# EasyEDA Pro project line_sensor.eprj

# Schematic Schematic1
Board Name: Board1; Create Date: 2026-02-10; Page Name: P1; Project Name: line_sensor; Schematic Name: Schematic1; Update Date: 2026-02-10; Company: EasyEDA.com; Page Size: A4; Version: V1.0
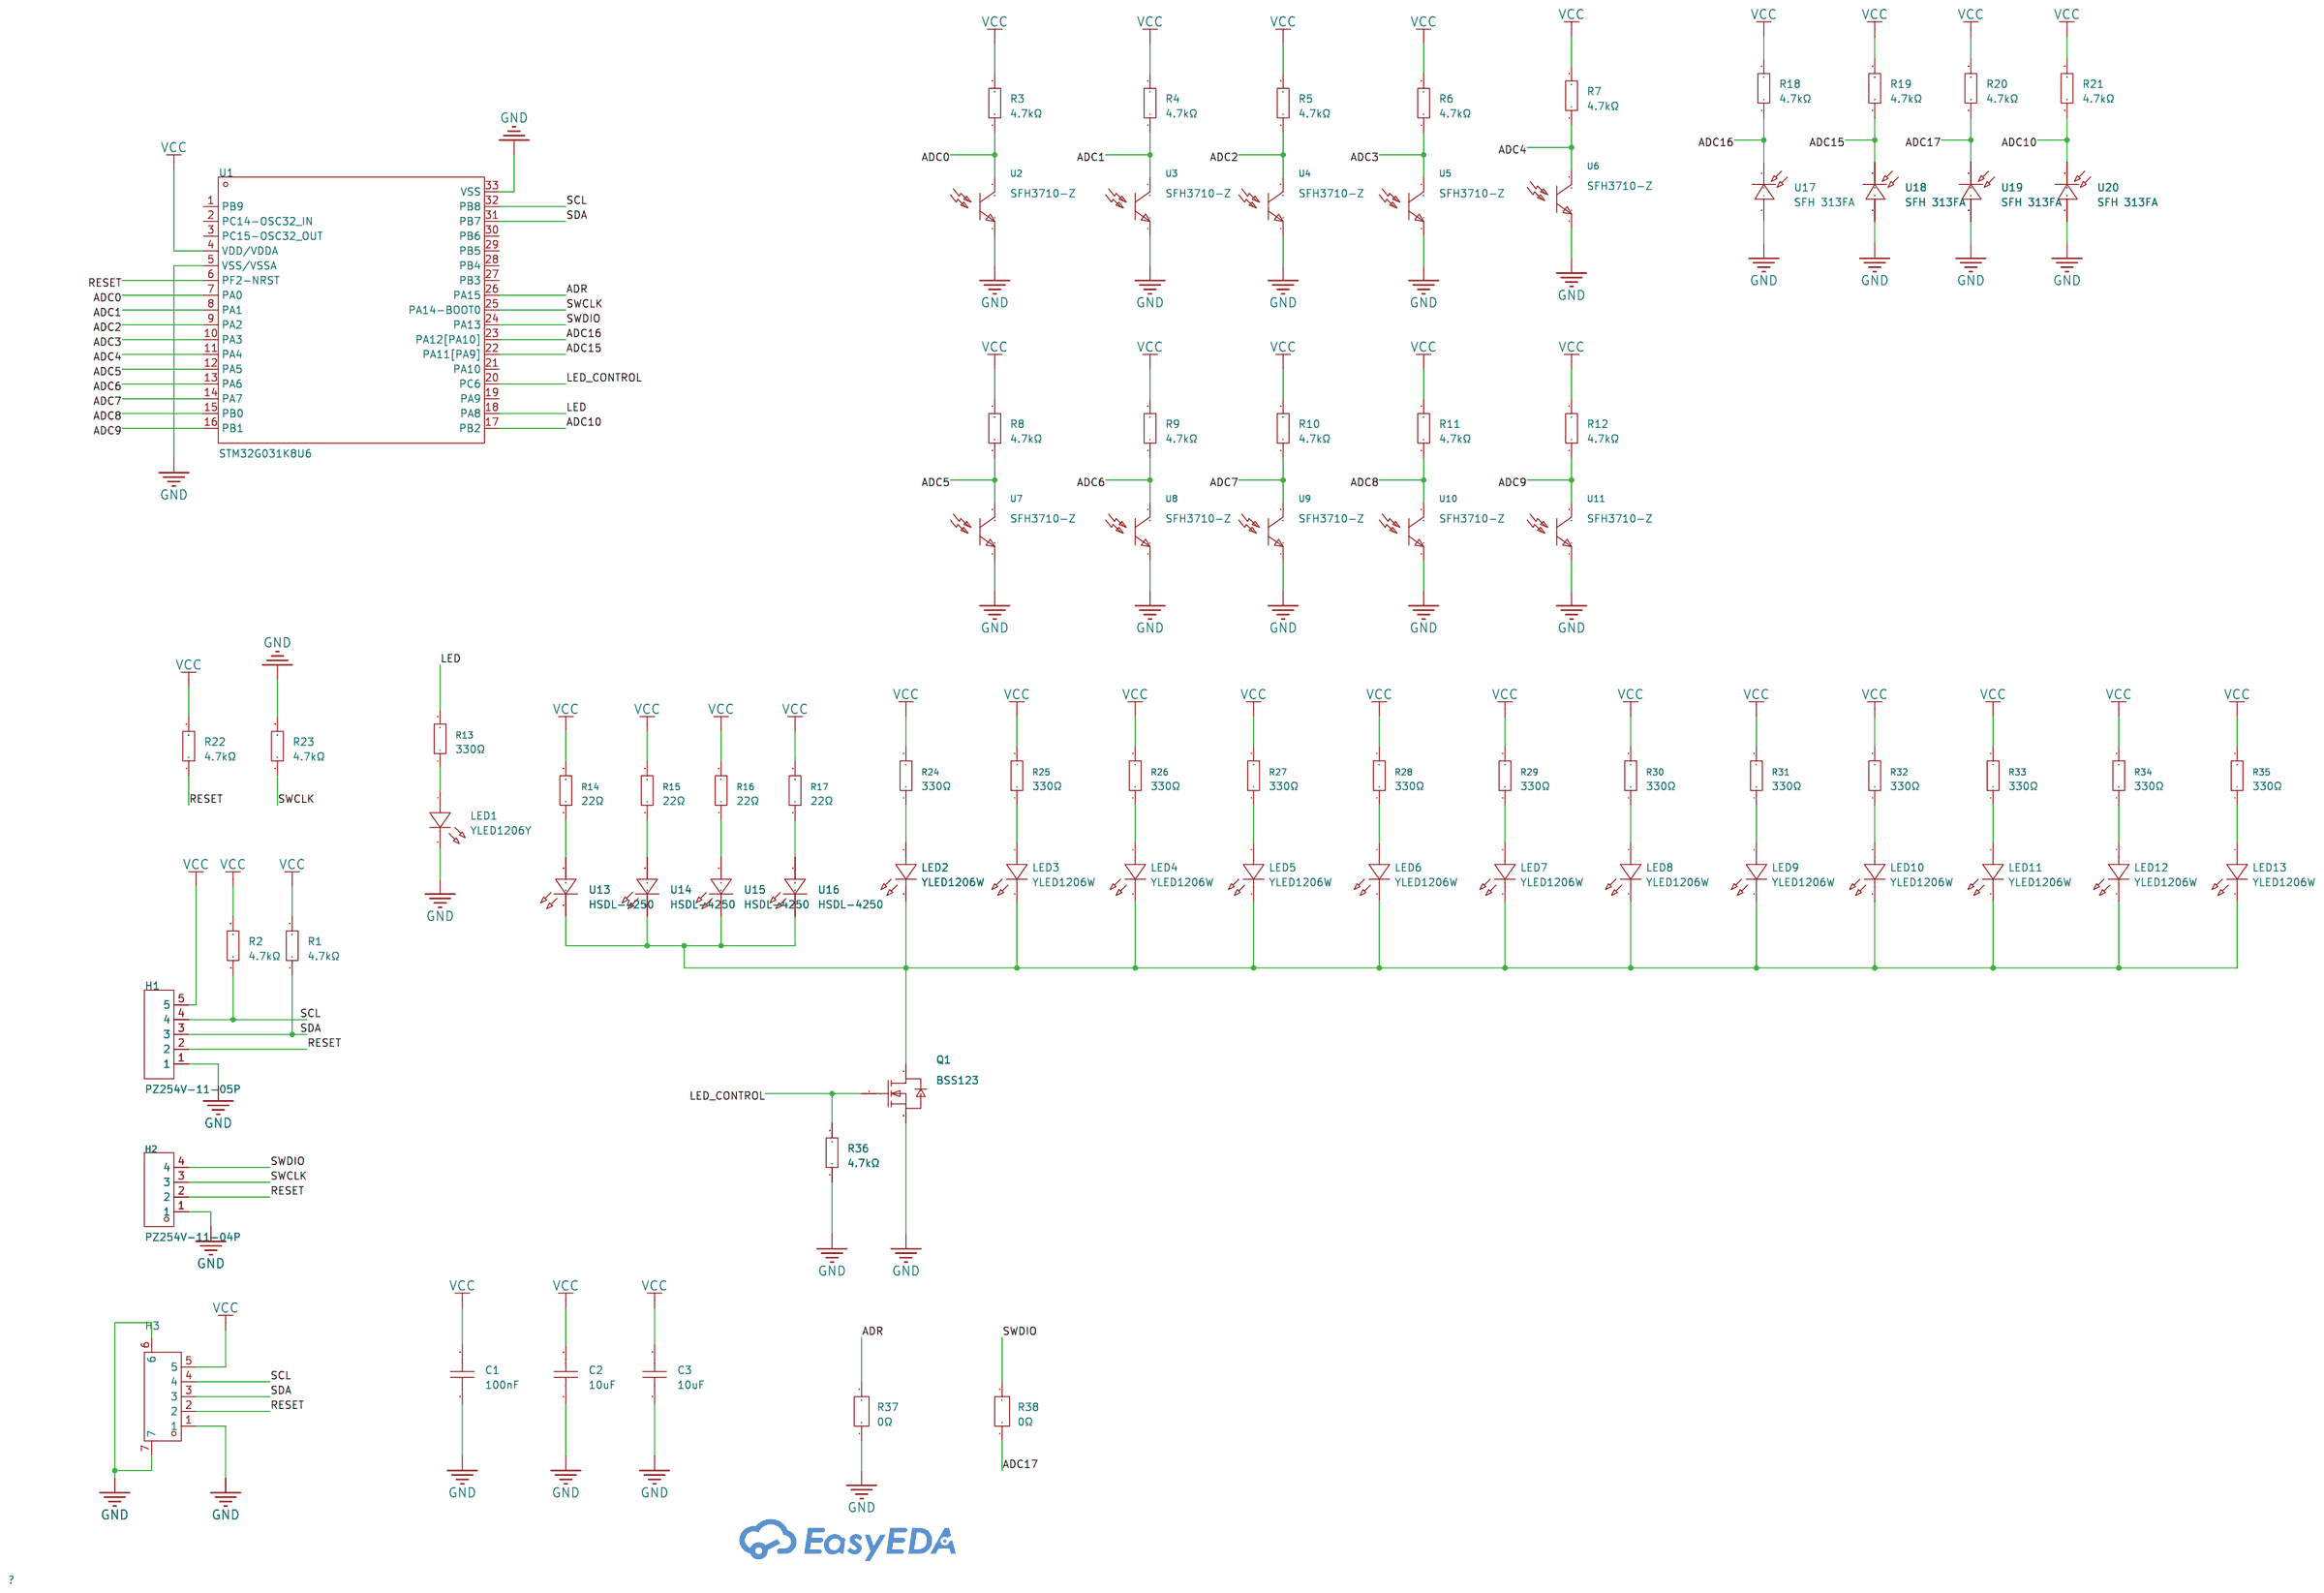
[diagram p0: schematic sheet]

## Parts
C1  100nF  [C0805]
C2  10uF  [C0805]
C3  10uF  [C0805]
H1  PZ254V-11-05P  [HDR-TH_5P-P2.54-V-M]
H2  PZ254V-11-04P  [HDR-TH_4P-P2.54-V-M]
H3  GT-F0509SR15-05SMT01  [CONN-SMD_GT-F0509SR15-05SMT01]
LED1  YLED1206Y  [LED1206-FD]
LED2  YLED1206W  [LED1206-R-RD]
LED3  YLED1206W  [LED1206-R-RD]
LED4  YLED1206W  [LED1206-R-RD]
LED5  YLED1206W  [LED1206-R-RD]
LED6  YLED1206W  [LED1206-R-RD]
LED7  YLED1206W  [LED1206-R-RD]
LED8  YLED1206W  [LED1206-R-RD]
LED9  YLED1206W  [LED1206-R-RD]
LED10  YLED1206W  [LED1206-R-RD]
LED11  YLED1206W  [LED1206-R-RD]
LED12  YLED1206W  [LED1206-R-RD]
LED13  YLED1206W  [LED1206-R-RD]
Q1  BSS123  [SOT-23-3_L3.0-W1.7-P0.95-LS2.9-BR]
R1  4.7kΩ  [R0805]
R2  4.7kΩ  [R0805]
R3  4.7kΩ  [R0805]
R4  4.7kΩ  [R0805]
R5  4.7kΩ  [R0805]
R6  4.7kΩ  [R0805]
R7  4.7kΩ  [R0805]
R8  4.7kΩ  [R0805]
R9  4.7kΩ  [R0805]
R10  4.7kΩ  [R0805]
R11  4.7kΩ  [R0805]
R12  4.7kΩ  [R0805]
R13  330Ω  [R0805]
R14  22Ω  [R0805]
R15  22Ω  [R0805]
R16  22Ω  [R0805]
R17  22Ω  [R0805]
R18  4.7kΩ  [R0805]
R19  4.7kΩ  [R0805]
R20  4.7kΩ  [R0805]
R21  4.7kΩ  [R0805]
R22  4.7kΩ  [R0805]
R23  4.7kΩ  [R0805]
R24  330Ω  [R0805]
R25  330Ω  [R0805]
R26  330Ω  [R0805]
R27  330Ω  [R0805]
R28  330Ω  [R0805]
R29  330Ω  [R0805]
R30  330Ω  [R0805]
R31  330Ω  [R0805]
R32  330Ω  [R0805]
R33  330Ω  [R0805]
R34  330Ω  [R0805]
R35  330Ω  [R0805]
R36  4.7kΩ  [R0805]
R37  0Ω  [R0603]
R38  0Ω  [R0603]
U1  STM32G031K8U6  [UFQFPN-32_L5.0-W5.0-P0.50-BL-EP]
U2  SFH3710-Z  [OPTO-SMD_SFH3710-Z]
U3  SFH3710-Z  [OPTO-SMD_SFH3710-Z]
U4  SFH3710-Z  [OPTO-SMD_SFH3710-Z]
U5  SFH3710-Z  [OPTO-SMD_SFH3710-Z]
U6  SFH3710-Z  [OPTO-SMD_SFH3710-Z]
U7  SFH3710-Z  [OPTO-SMD_SFH3710-Z]
U8  SFH3710-Z  [OPTO-SMD_SFH3710-Z]
U9  SFH3710-Z  [OPTO-SMD_SFH3710-Z]
U10  SFH3710-Z  [OPTO-SMD_SFH3710-Z]
U11  SFH3710-Z  [OPTO-SMD_SFH3710-Z]
U13  HSDL-4250  [LED-TH_BD5.0-P2.54-FD-1]
U14  HSDL-4250  [LED-TH_BD5.0-P2.54-FD-1]
U15  HSDL-4250  [LED-TH_BD5.0-P2.54-FD-1]
U16  HSDL-4250  [LED-TH_BD5.0-P2.54-FD-1]
U17  SFH 313FA  [OPTO-TH_BD5.7-P2.54-D0.8]
U18  SFH 313FA  [OPTO-TH_BD5.7-P2.54-D0.8]
U19  SFH 313FA  [OPTO-TH_BD5.7-P2.54-D0.8]
U20  SFH 313FA  [OPTO-TH_BD5.7-P2.54-D0.8]

## Library data of the parts
C1 = CC0805KRX7R9BB104: LCSC Part Name: 100nF ±10% 50V; Supplier Part: C49678; Manufacturer: YAGEO(国巨); Supplier Footprint: 0805; JLCPCB Part Class: Basic Part; Datasheet: https://item.szlcsc.com/datasheet/CC0805KRX7R9BB104/50686.html; Supplier: LCSC; Tolerance: ±10%; Voltage Rating: 50V; Temperature Coefficient: X7R
C2 C3 = CL21A106KBYQNNE: LCSC Part Name: 10uF ±10% 50V; Supplier Part: C2932476; Manufacturer: SAMSUNG(三星); Supplier Footprint: 0805; JLCPCB Part Class: Extended Part; Datasheet: https://item.szlcsc.com/datasheet/CL21A106KBYQNNE/3277789.html; Supplier: LCSC; Tolerance: ±10%; Voltage Rating: 50V; Temperature Coefficient: X5R
H1 = PZ254V-11-05P: LCSC Part Name: 1x5P 间距:2.54mm 方针 直插; Supplier Part: C492404; Manufacturer: XFCN(兴飞); Supplier Footprint: 插件,P=2.54mm; JLCPCB Part Class: Extended Part; Datasheet: https://item.szlcsc.com/datasheet/PZ254V-11-05P/502960.html; Supplier: LCSC; Pin Structure: 1x5P; Pitch: 2.54mm; Circluar Pins/Square Pins: Pin Header; Mounting Type: Through Hole; Number of Rows: 1; Number of Pins: 5P; Length of Mating Pin: 6mm; Insulation Height: 2.5mm; Length of End Connection Pin: 3mm; Contact Material: Brass; Operating Temperature: -40℃~+105℃; Color: Black
H2 = PZ254V-11-04P: LCSC Part Name: 1x4P 间距:2.54mm 方针 直插; Supplier Part: C2691448; Manufacturer: XFCN(兴飞); Supplier Footprint: 插件,P=2.54mm; JLCPCB Part Class: Extended Part; Datasheet: https://item.szlcsc.com/datasheet/PZ254V-11-04P/2801085.html; Supplier: LCSC; Pin Structure: 1x4P; Pitch: 2.54mm; Circluar Pins/Square Pins: Pin Header; Mounting Type: Through Hole; Number of Rows: 1; Number of Pins: 4P; Current Rating: 3A; Voltage Rating (Max): 250V; Length of Mating Pin: 6mm; Insulation Height: 2.5mm; Length of End Connection Pin: 3mm; Operating Temperature: -40℃~+105℃; Color: Black
H3 = GT-F0509SR15-05SMT01: Locking Feature:Hinged Lid Contact Type:Bottom Contact Number of Contacts:5P Pitch:0.5mm Mounting Type:Surface Mount, Right Angle FFC, FCB Thickness:0.3mm FFC, FCB Thickness:0.3mm Height Above Board:1.53mm Contact Material:Phosphor Bronze Contact Plating:; LCSC Part Name: 翻盖式 下接 P数:5P 间距:0.5mm; Supplier Part: C21882317; Manufacturer: G-Switch(品赞); Supplier Footprint: SMD,P=0.5mm,卧贴; JLCPCB Part Class: Extended Part; Datasheet: https://item.szlcsc.com/datasheet/GT-F0509SR15-05SMT01/23309883.html; Supplier: LCSC; Locking Feature: Hinged Lid; Contact Type: Bottom Contact; Number of Contacts: 5P; Pitch: 0.5mm; Mounting Type: Surface Mount, Right Angle; FFC, FCB Thickness: 0.3mm; Height Above Board: 1.53mm; Contact Material: Phosphor Bronze; Contact Plating: Tin; Operating Temperature: -25℃~+85℃
LED1 = YLED1206Y: LCSC Part Name: 发光管; Supplier Part: C30584802; Manufacturer: YONGYUTAI(永裕泰); Supplier Footprint: 1206; JLCPCB Part Class: Extended Part; Datasheet: https://item.szlcsc.com/datasheet/YLED1206Y/32319014.html; Supplier: LCSC; Illumination Color: Yellow; Voltage - Forward(Vf): 1.8V~2.4V; Power(Watts): 48mW; Forward Current: 20mA; Wavelength - Dominant: 584nm~594nm; Peak Wavelength: 596nm; Luminous Intensity: 70mcd~210mcd; Viewing Angle: 120°; Operating Temperature: -40℃~+85℃
LED2-LED13 = YLED1206W: LCSC Part Name: 发光管; Supplier Part: C28310437; Manufacturer: YONGYUTAI(永裕泰); Supplier Footprint: 1206; JLCPCB Part Class: Extended Part; Datasheet: https://item.szlcsc.com/datasheet/YLED1206W/30046764.html; Supplier: LCSC; Illumination Color: White; Voltage - Forward(Vf): 2.6V~3.1V; Power(Watts): 70mW; Forward Current: 20mA; Color Temperature: 13969K~100000K; Luminous Intensity: 175mcd~430mcd; Viewing Angle: 120°; Operating Temperature: -40℃~+85℃
Q1 = BSS123_2: LCSC Part Name: N沟道,电流:170mA,耐压:100V; Supplier Part: C41355122; Manufacturer: Siliup(矽普); Supplier Footprint: SOT-23; Datasheet: https://atta.szlcsc.com/upload/public/pdf/source/20240815/F5B63F8FE9D005365415E1A86BED304A.pdf; Supplier: LCSC; Drain to Source Voltage: 100V; Current - Continuous Drain(Id): 170mA; RDS(on): 4.3Ω@4.5V,200mA; Pd - Power Dissipation: 350mW; Gate Threshold Voltage (Vgs(th)@Id): 2.5V; Gate Charge(Qg): 2nC@10V; Input Capacitance(Ciss): 60pF; Reverse Transfer Capacitance (Crss@Vds): 6pF; Operating Temperature: -55℃~+150℃
R1-R12 R18-R23 R36 = 0805W8F4701T5E: LCSC Part Name: 4.7kΩ ±1% 125mW 厚膜电阻; Supplier Part: C17673; Manufacturer: UNI-ROYAL(厚声); Supplier Footprint: 0805; JLCPCB Part Class: Basic Part; Datasheet: https://atta.szlcsc.com/upload/public/pdf/source/20200306/C422600_1E6D84923E4A46A82E41ADD87F860B5C.pdf; Supplier: LCSC; Type: Thick Film Resistors; Tolerance: ±1%; Temperature Coefficient: ±100ppm/℃; Operating Temperature Range: -55℃~+155℃
R13-R17 R24-R35 = 0805W8F3300T5E: LCSC Part Name: 330Ω ±1% 125mW 厚膜电阻; Supplier Part: C17630; Manufacturer: UNI-ROYAL(厚声); Supplier Footprint: 0805; JLCPCB Part Class: Basic Part; Datasheet: https://item.szlcsc.com/datasheet/0805W8F3300T5E/18318.html; Supplier: LCSC; Type: Thick Film Resistor; Tolerance: ±1%; Power(Watts): 125mW; Voltage-Supply(Max): 150V; Temperature Coefficient: ±100ppm/℃; Operating Temperature: -55℃~+155℃
R37 R38 = FRC0603P000 TS: LCSC Part Name: 0Ω ±5% 100mW 厚膜电阻; Supplier Part: C2907080; Manufacturer: FOJAN(富捷); Supplier Footprint: 0603; JLCPCB Part Class: Extended Part; Supplier: LCSC; Type: Thick Film Resistor; Tolerance: ±5%; Power(Watts): 100mW; Voltage-Supply(Max): 75V; Operating Temperature: -55℃~+155℃
U1 = STM32G031K8U6: LCSC Part Name: 主流Arm Cortex-M0+ MCU，具有64 KB Flash存储器、8 KB RAM、64 MHz CPU、2x USART、定时器、ADC和通信接口，1.7-3.6V; Supplier Part: C432207; Manufacturer: ST(意法半导体); Supplier Footprint: UFQFPN-32(5x5); JLCPCB Part Class: Extended Part; Datasheet: https://item.szlcsc.com/datasheet/STM32G031K8U6/428995.html; Supplier: LCSC; CPU Core: ARM Cortex-M Series; CPU Maximum Speed: 64MHz; Program Storage Size: 64KB; Program Memory Type: FLASH; Number of I/O: 30; ADC (Bit): 12bit; Voltage - Supply: 1.7V~3.6V
U2-U11 = SFH3710-Z: LCSC Part Name: 570nm光电三极管; Supplier Part: C129152; Manufacturer: OSRAM(欧司朗); Supplier Footprint: SMD,3.2x1.3mm; JLCPCB Part Class: Extended Part; Datasheet: https://item.szlcsc.com/datasheet/SFH3710-Z/140438.html; Supplier: LCSC; type: NPN; Collector - Emitter Voltage VCEO: 5.5V; Current - Collector(Ic): 20mA; Current - Dark(Id): 3nA; Peak Wavelength: 570nm; Viewing Angle: ±60°; Operating Temperature: -40℃~+85℃
U13-U16 = HSDL-4250: Supplier Part: C5730862; Manufacturer: LITEON(光宝); JLCPCB Part Class: Extended Part; Datasheet: https://item.szlcsc.com/datasheet/HSDL-4250/6656316.html; Supplier: LCSC; Voltage - Forward(Vf): 1.4V; Wavelength: 870nm; Radiant Intensity: 124mW/sr@100mA; Operating Temperature: -40℃~+85℃
U17-U20 = SFH 313FA: Supplier Part: C3210896; Manufacturer: OSRAM(欧司朗); Supplier Footprint: 插件; JLCPCB Part Class: Extended Part; Supplier: LCSC; Collector Emitter Voltage: 70V; Collector Current (Ic): 50mA; Dissipation Power(Max): 200mW; Collector Dark Current: 200nA; Peak Wavelength: 870nm; Operating Temperature: -40℃~+100℃

## Nets
GND: C1.1 C2.1 C3.1 H1.1 H2.1 H3.1 H3.6 H3.7 LED1.2(C) Q1.2(S) R23.2 R36.1 R37.1 U1.5(VSS/VSSA) U1.33(VSS) U2.1(E) U3.1(E) U4.1(E) U5.1(E) U6.1(E) U7.1(E) U8.1(E) U9.1(E) U10.1(E) U11.1(E) U17.2(A) U18.2(A) U19.2(A) U20.2(A)
VCC: C1.2 C2.2 C3.2 H1.5 H3.5 R1.2 R2.2 R3.2 R4.2 R5.2 R6.2 R7.2 R8.2 R9.2 R10.2 R11.2 R12.2 R14.2 R15.2 R16.2 R17.2 R18.2 R19.2 R20.2 R21.2 R22.2 R24.2 R25.2 R26.2 R27.2 R28.2 R29.2 R30.2 R31.2 R32.2 R33.2 R34.2 R35.2 U1.4(VDD/VDDA)
ADC0: R3.1 U1.7(PA0) U2.2(C)
ADC1: R4.1 U1.8(PA1) U3.2(C)
ADC2: R5.1 U1.9(PA2) U4.2(C)
ADC3: R6.1 U1.10(PA3) U5.2(C)
ADC4: R7.1 U1.11(PA4) U6.2(C)
ADC5: R8.1 U1.12(PA5) U7.2(C)
ADC6: R9.1 U1.13(PA6) U8.2(C)
ADC7: R10.1 U1.14(PA7) U9.2(C)
ADC8: R11.1 U1.15(PB0) U10.2(C)
ADC9: R12.1 U1.16(PB1) U11.2(C)
ADC10: R21.1 U1.17(PB2) U20.1(C)
ADC15: R19.1 U1.22(PA11[PA9]) U18.1(C)
ADC16: R18.1 U1.23(PA12[PA10]) U17.1(C)
ADC17: R20.1 R38.1 U19.1(C)
ADR: R37.2 U1.26(PA15)
LED: R13.2 U1.18(PA8)
LED_CONTROL: Q1.1(G) R36.2 U1.20(PC6)
RESET: H1.2 H2.2 H3.2 R22.1 U1.6(PF2-NRST)
SCL: H1.4 H3.4 R2.1 U1.32(PB8)
SDA: H1.3 H3.3 R1.1 U1.31(PB7)
SWCLK: H2.3 R23.1 U1.25(PA14-BOOT0)
SWDIO: H2.4 R38.2 U1.24(PA13)
$1N3964: R14.1 U13.1(A)
$1N3993: R15.1 U14.1(A)
$1N3998: R16.1 U15.1(A)
$1N4003: R17.1 U16.1(A)
$1N4008: LED2.2(K) LED3.2(K) LED4.2(K) LED5.2(K) LED6.2(K) LED7.2(K) LED8.2(K) LED9.2(K) LED10.2(K) LED11.2(K) LED12.2(K) LED13.2(K) Q1.3(D) U13.2(C) U14.2(C) U15.2(C) U16.2(C)
$1N4729: LED1.1(A) R13.1
$1N4864: LED2.1(A) R24.1
$1N4985: LED3.1(A) R25.1
$1N5087: LED4.1(A) R26.1
$1N5189: LED5.1(A) R27.1
$1N5291: LED6.1(A) R28.1
$1N5393: LED7.1(A) R29.1
$1N5495: LED8.1(A) R30.1
$1N5597: LED9.1(A) R31.1
$1N5699: LED10.1(A) R32.1
$1N5801: LED11.1(A) R33.1
$1N5903: LED12.1(A) R34.1
$1N6005: LED13.1(A) R35.1

Not connected (* = marked no-connect by the designer): U1 1(PB9) 2(PC14-OSC32_IN) 3(PC15-OSC32_OUT) 19(PA9) 21(PA10) 27(PB3) 28(PB4) 29(PB5) 30(PB6)

# Board PCB1
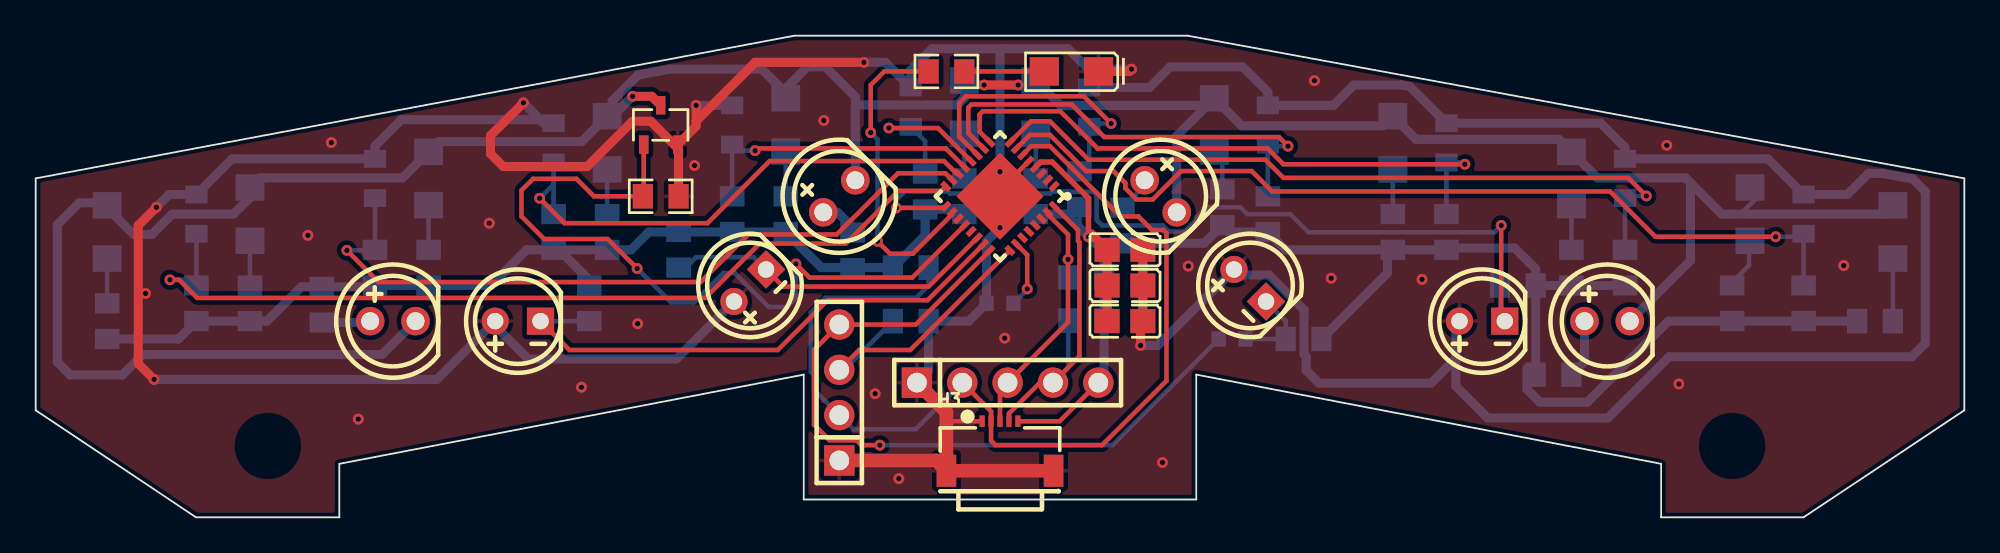
[diagram p1: board, top side]
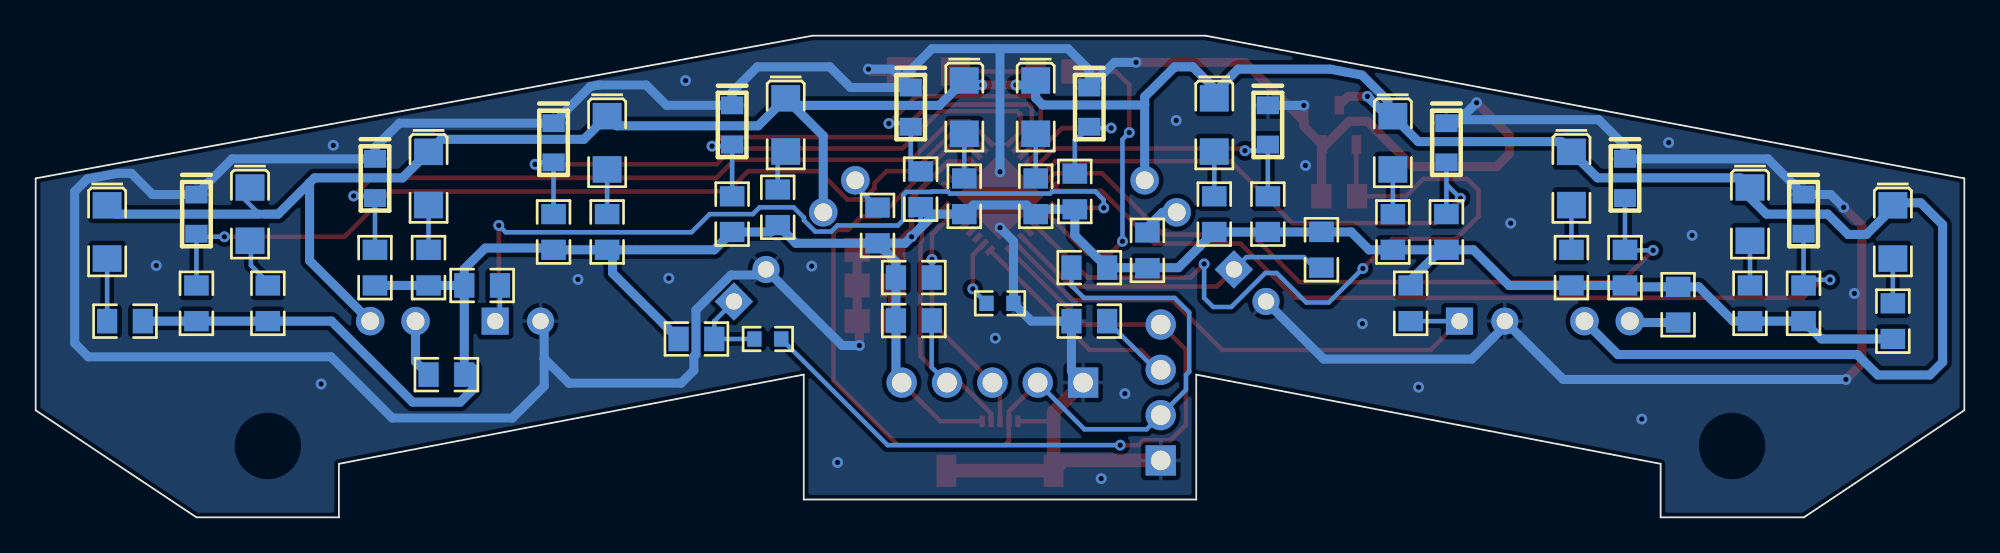
[diagram p2: board, bottom side, seen from below]

Outline 108 x 27.01 mm; copper layers: Top Layer, Bottom Layer. Coordinates in mm from the lower left corner of the outline.
Outline path: 0,19 0,6 8.98,0 17,0 17,3 43.01,8 43.01,1 64.99,1 64.99,8 91.02,3 91.02,0 99,0 108,6 108,19 64.49,27.01 42.49,27.01 0,19
Stack: Top Layer 0.035mm / Dielectric1 1.51mm FR4 er 4.5 / Bottom Layer 0.035mm

## Design rules (mm)
template: JLCPCB Capability(Two Layers Board)
spacing copperThickness1oz (default): track to track 0.102, other pairs 0.152 to 0.3
spacing copperThickness2oz: track to track 0.203, other pairs 0.152 to 0.3
track width copperThickness1oz (default): min 0.127, default 0.254, max 2.54
track width copperThickness2oz: min 0.203, default 0.254, max 2.54
differential pair differentialPair (default): width min 0.127, default 0.254, max 2.54; gap min 0.152, default 0.152
via viaSize (default): diameter min 0.5, default 0.61, max 10; hole min 0.3, default 0.305, max 6.3

## Placement (name value [footprint] x y rotation side)
C1  100nF  [C0805]  61 15 180 top
C2  10uF  [C0805]  61 13 180 top
C3  10uF  [C0805]  61 11 180 top
H1  PZ254V-11-05P  [HDR-TH_5P-P2.54-V-M]  54.43 7.55 0 top
H2  PZ254V-11-04P  [HDR-TH_4P-P2.54-V-M]  45 7 90 top
H3  GT-F0509SR15-05SMT01  [CONN-SMD_GT-F0509SR15-05SMT01]  54 4 0 top
LED1  YLED1206Y  [LED1206-FD]  58 25 0 top
LED2  YLED1206W  [LED1206-R-RD]  12 17 270 bottom
LED3  YLED1206W  [LED1206-R-RD]  22 19 270 bottom
LED4  YLED1206W  [LED1206-R-RD]  32 21 270 bottom
LED5  YLED1206W  [LED1206-R-RD]  42 22 270 bottom
LED6  YLED1206W  [LED1206-R-RD]  52 23 270 bottom
LED7  YLED1206W  [LED1206-R-RD]  56 23 270 bottom
LED8  YLED1206W  [LED1206-R-RD]  66 22 270 bottom
LED9  YLED1206W  [LED1206-R-RD]  76 21 270 bottom
LED10  YLED1206W  [LED1206-R-RD]  86 19 270 bottom
LED11  YLED1206W  [LED1206-R-RD]  96 17 270 bottom
LED12  YLED1206W  [LED1206-R-RD]  104 16 270 bottom
LED13  YLED1206W  [LED1206-R-RD]  4 16 270 bottom
Q1  BSS123  [SOT-23-3_L3.0-W1.7-P0.95-LS2.9-BR]  35 22 270 top
R1  4.7kΩ  [R0805]  58.83 13.44 0 bottom
R2  4.7kΩ  [R0805]  58.83 11.03 0 bottom
R3  4.7kΩ  [R0805]  99 12 270 bottom
R4  4.7kΩ  [R0805]  89 14 270 bottom
R5  4.7kΩ  [R0805]  79 16 270 bottom
R6  4.7kΩ  [R0805]  69 17 270 bottom
R7  4.7kΩ  [R0805]  58.44 18.4 270 bottom
R8  4.7kΩ  [R0805]  49.81 18.27 270 bottom
R9  4.7kΩ  [R0805]  39 17 270 bottom
R10  4.7kΩ  [R0805]  29 16 270 bottom
R11  4.7kΩ  [R0805]  19 14 270 bottom
R12  4.7kΩ  [R0805]  9 12 270 bottom
R13  330Ω  [R0805]  51 25 180 top
R14  22Ω  [R0805]  16.03 11.92 90 bottom
R15  22Ω  [R0805]  45.75 14.97 270 bottom
R16  22Ω  [R0805]  60.86 16.37 270 bottom
R17  22Ω  [R0805]  85 8 180 bottom
R18  4.7kΩ  [R0805]  31 12 90 bottom
R19  4.7kΩ  [R0805]  36 15 90 bottom
R20  4.7kΩ  [R0805]  71 10 0 bottom
R21  4.7kΩ  [R0805]  83 13 0 bottom
R22  4.7kΩ  [R0805]  49 14 180 bottom
R23  4.7kΩ  [R0805]  49 11 0 bottom
R24  330Ω  [R0805]  12 12 270 bottom
R25  330Ω  [R0805]  22 14 270 bottom
R26  330Ω  [R0805]  32 16 270 bottom
R27  330Ω  [R0805]  42 17 270 bottom
R28  330Ω  [R0805]  52 18 270 bottom
R29  330Ω  [R0805]  56 18 270 bottom
R30  330Ω  [R0805]  66.45 17.38 270 bottom
R31  330Ω  [R0805]  76 16 270 bottom
R32  330Ω  [R0805]  86 14 270 bottom
R33  330Ω  [R0805]  95 12 270 bottom
R34  330Ω  [R0805]  103 11 180 bottom
R35  330Ω  [R0805]  4 11 270 bottom
R36  4.7kΩ  [R0805]  35 18 180 top
R37  0Ω  [R0603]  54 12 0 bottom
R38  0Ω  [R0603]  67 10 180 bottom
U1  STM32G031K8U6  [UFQFPN-32_L5.0-W5.0-P0.50-BL-EP]  54 18 135 top
U2  SFH3710-Z  [OPTO-SMD_SFH3710-Z]  99 17 270 bottom
U3  SFH3710-Z  [OPTO-SMD_SFH3710-Z]  89 19 270 bottom
U4  SFH3710-Z  [OPTO-SMD_SFH3710-Z]  79 21 270 bottom
U5  SFH3710-Z  [OPTO-SMD_SFH3710-Z]  69 22 270 bottom
U6  SFH3710-Z  [OPTO-SMD_SFH3710-Z]  59 23 270 bottom
U7  SFH3710-Z  [OPTO-SMD_SFH3710-Z]  49 23 270 bottom
U8  SFH3710-Z  [OPTO-SMD_SFH3710-Z]  39 22 270 bottom
U9  SFH3710-Z  [OPTO-SMD_SFH3710-Z]  29 21 270 bottom
U10  SFH3710-Z  [OPTO-SMD_SFH3710-Z]  19 19 270 bottom
U11  SFH3710-Z  [OPTO-SMD_SFH3710-Z]  9 17 270 bottom
U13  HSDL-4250  [LED-TH_BD5.0-P2.54-FD-1]  20 11 0 top
U14  HSDL-4250  [LED-TH_BD5.0-P2.54-FD-1]  45 18 45 top
U15  HSDL-4250  [LED-TH_BD5.0-P2.54-FD-1]  63 18 315 top
U16  HSDL-4250  [LED-TH_BD5.0-P2.54-FD-1]  88 11 0 top
U17  SFH 313FA  [OPTO-TH_BD5.7-P2.54-D0.8]  27 11 180 top
U18  SFH 313FA  [OPTO-TH_BD5.7-P2.54-D0.8]  40 13 225 top
U19  SFH 313FA  [OPTO-TH_BD5.7-P2.54-D0.8]  68 13 135 top
U20  SFH 313FA  [OPTO-TH_BD5.7-P2.54-D0.8]  81 11 180 top

## Footprints (pads in the part's own frame, mm; a bottom-side part is the same pattern mirrored in y, then rotated)
C0805
  rect 1.41x1.35 smd: 1(-1,0) 2(1,0)
CONN-SMD_GT-F0509SR15-05SMT01
  rect 0.3x0.65 smd: 1(-1,1.387) 2(-0.5,1.387) 3(-0.001,1.387) 4(0.499,1.387) 5(1,1.387)
  rect 1.1x1.8 smd: 6(3,-1.387) 7(-3,-1.387)
HDR-TH_4P-P2.54-V-M
  rect 1.7x1.7 hole 1.1: 1(-3.81,0)
  round 1.7 hole 1.1: 2(-1.27,0) 3(1.27,0) 4(3.81,0)
HDR-TH_5P-P2.54-V-M
  rect 1.7x1.7 hole 1.1: 1(-5.08,0)
  round 1.7 hole 1.1: 2(-2.54,0) 3(0,0) 4(2.54,0) 5(5.08,0)
LED1206-FD
  rect 1.635x1.6 smd: 1(-1.518,0) 2(1.518,0)
LED1206-R-RD
  rect 1.485x1.62 smd: 1(1.492,0) 2(-1.492,0)
LED-TH_BD5.0-P2.54-FD-1
  round 1.6 hole 1: 1(-1.27,0) 2(1.27,0)
OPTO-SMD_SFH3710-Z
  rect 1x1.25 smd: 1(-1.1,0) 2(1.1,0)
OPTO-TH_BD5.7-P2.54-D0.8
  rect 1.524x1.524 hole 0.914: 1(-1.27,0)
  round 1.524 hole 0.914: 2(1.27,0)
R0603
  rect 0.806x0.864 smd: 1(-0.753,0) 2(0.753,0)
R0805
  rect 1.133x1.377 smd: 1(-1,0) 2(1,0)
SOT-23-3_L3.0-W1.7-P0.95-LS2.9-BR
  rect 1.038x0.532 smd: 1(1.101,-0.95) 2(1.101,0.95) 3(-1.101,0)
UFQFPN-32_L5.0-W5.0-P0.50-BL-EP
  rect 0.3x0.6 smd: 1(-1.75,-2.54) 2(-1.25,-2.54) 3(-0.75,-2.54) 4(-0.25,-2.54) 5(0.25,-2.54) 6(0.75,-2.54) 7(1.25,-2.54) 8(1.75,-2.54) 17(1.75,2.54) 18(1.25,2.54) 19(0.75,2.54) 20(0.25,2.54) 21(-0.25,2.54) 22(-0.75,2.54) 23(-1.25,2.54) 24(-1.75,2.54)
  rect 0.6x0.3 smd: 9(2.54,-1.75) 10(2.54,-1.25) 11(2.54,-0.75) 12(2.54,-0.25) 13(2.54,0.25) 14(2.54,0.75) 15(2.54,1.25) 16(2.54,1.75) 25(-2.54,1.75) 26(-2.54,1.25) 27(-2.54,0.75) 28(-2.54,0.25) 29(-2.54,-0.25) 30(-2.54,-0.75) 31(-2.54,-1.25) 32(-2.54,-1.75)
  rect 3.45x3.45 smd: 33(0,0)

## Nets
As in the schematic.

Pads without a net: U1 1 2 3 19 21 27 28 29 30

## Via types
v1: diameter 0.61, hole 0.305, Top Layer to Bottom Layer, 52 vias

## Routing (per net, layer and track width the routed paths; a pad name or vN(x,y) marks a point on that pad's centre or on a via; arc(x,y) is an arc through that point)
GND: length 293.6
  Top Layer w0.254: U1.33 54,18.35 U1.5 ; H3.1 51,5.39
  Top Layer w0.508: LED1.2 61.24,25 v1(61.37,25.13) ; 36.98,22.21 v1(36.98,23.1) ; 36.98,22.21 36.98,21.93 Q1.2 ; 36.98,22.21 40.28,25.51 v1(46.38,25.51) ; 62,11.28 C2.1 C1.1 ; 62,11.28 61.87,11.15 v1(61.87,9.64) ; 62,11.28 C3.1 ; v1(27.31,23.24) 25.47,21.4 25.47,20.39 26.19,19.67 30.89,19.67 33.43,22.21 34.44,22.21 36,20.65 R36.1 ; v1(54,16.24) U1.33 ; v1(6.76,17.38) 5.74,16.37 5.74,8.62 v1(6.63,7.73)
  Top Layer w0.762: H3.6 H3.7 ; H3.7 50.42,3.19 H2.1 ; H3.7 51,5.9 49.35,7.55
  Bottom Layer w0.508: U18.2 35.87,8.87 27.58,8.87 25.73,10.73 U17.2 22.46,7.73 v1(6.63,7.73) ; 28.26,22.3 28.45,22.1 U9.1 ; 28.26,22.3 v1(27.31,23.24) ; 28.26,22.3 20.48,22.3 19,20.82 U10.1 11,20.1 U11.1 7.47,18.1 v1(6.76,17.38) ; 54.09,26.27 50.19,26.27 49,25.08 U7.1 47.59,25.51 v1(46.38,25.51) ; 54.09,26.27 57.81,26.27 59.49,24.59 60.03,25.13 v1(61.37,25.13) ; 54.09,26.27 54,26.19 v1(54,19.37) ; U8.1 39,23.1 v1(36.98,23.1) ; v1(61.87,9.64) 62.84,9.64 U19.2 ; 49.35,7.55 50,8.21 R23.2 52.25,11 R37.1 53.25,15.49 v1(54,16.24) ; 67.41,13.59 69.07,13.59 71.03,11.62 71.03,9.14 71.15,9.03 71.15,8.24 71.86,7.52 78.14,7.52 79.53,8.91 ; U20.2 79.53,10.8 79.53,8.91 ; 79.53,8.91 79.53,7.35 81.31,5.57 88.04,5.57 91.47,9 105.05,9 105.82,9.76 105.82,18.27 105.12,18.97 103.4,19.29 102.64,19.29 101.45,18.1 U2.1 97,20.1 U3.1 89,20.74 87.64,22.1 U4.1 76.95,24.15 76.47,24.24 73.81,24.24 72.67,23.1 U5.1 69,23.84 67.59,25.26 63.53,25.26 62.37,24.1 U6.1
  vias: v1(6.15,12.56) v1(15.24,15.81) v1(16.55,21.01) v1(18.06,5.51) v1(25.4,16.49) v1(30.56,7.3) v1(33.71,10.86) v1(36.89,19.73) v1(44.13,22.25) v1(47.01,6.93) v1(48.33,2.17) v1(54.26,10.05) v1(63.1,3.08) v1(64.54,14.09) v1(71.61,24.49) v1(72.55,13.41) v1(77.63,13.34) v1(91.34,20.86) v1(92.02,7.48) v1(101.25,14.12)
VCC: length 156.4
  Top Layer w0.254: H3.5 57.34,5.39 H1.5
  Top Layer w0.305: U1.4 56.28,19.92 56.92,19.92 58.95,17.89 v1(58.95,15.73)
  Top Layer w0.508: C3.2 C2.2 C1.2 59.11,15.89 v1(58.95,15.73)
  Bottom Layer w0.254: R7.2 58.44,16.24
  Bottom Layer w0.508: 29.3,15 31,13.3 R18.2 ; 29.3,15 R26.2 33.33,15 34.33,16 R19.2 R9.2 R27.2 44,14 R22.2 49.81,15.81 R8.2 51.73,17.27 R28.2 52.51,17.51 55.49,17.51 R29.2 57.68,17 v1(58.95,15.73) 59.32,15.37 R16.2 ; 29.3,15 R10.2 27.49,15 25.49,13 R25.2 R11.2 18.92,12.92 R14.2 14.87,12.92 12.95,11 R24.2 R12.2 8,10 R35.2 ; 83.51,8.37 83.51,7.18 84.23,6.46 86.89,6.46 91.43,11 R33.2 R3.2 R34.2 ; 84,8.37 R21.2 ; R21.2 84,13.92 82.83,15.1 79.1,15.1 R5.2 R31.2 75.7,15 ; R21.2 R32.2 R4.2 ; 75.7,15 70,15 R6.2 66.83,16 R30.2 65.43,15.37 R16.2 ; 75.7,15 75.7,13.7 R20.2 ; R16.2 59.83,14.33 R1.2 R2.2 59.83,7.87 H1.5
ADC0: length 51.2
  Top Layer w0.254: v1(97.43,15.73) 90.7,15.73 88.16,18.27 69.24,18.27 68.1,19.41 64.14,19.41 62.55,17.82 61.66,17.82 61.02,18.45 61.02,18.74 60.35,19.41 58.83,19.41 56.79,21.45 55.68,21.45 U1.7
  Bottom Layer w0.254: R3.1 U2.2 98.83,15.73 v1(97.43,15.73)
ADC1: length 42
  Top Layer w0.254: v1(90.19,18.02) 89.18,19.03 69.88,19.03 68.86,20.05 58.95,20.05 56.79,22.21 55.73,22.21 54.56,21.03
  Bottom Layer w0.254: v1(90.19,18.02) 89.12,18.02 U3.2 R4.1
ADC2: length 34.3
  Top Layer w0.254: U1.9 52.86,21.62 52.86,22.59 53.04,22.77 57.38,22.77 59.46,20.68 68.99,20.68 69.88,19.8 v1(80.03,19.8)
  Bottom Layer w0.254: R5.1 U4.2 79.93,19.9 v1(80.03,19.8)
ADC3: length 25.6
  Top Layer w0.254: v1(70.13,20.81) 69.62,21.32 59.84,21.32 58.01,23.15 52.4,23.15 52.22,22.97 52.22,21.55 U1.10
  Bottom Layer w0.254: R6.1 69,20.72 69.09,20.81 ; v1(70.13,20.81) 69.09,20.81 ; 69.09,20.81 U5.2
ADC4: length 16.6
  Top Layer w0.254: U1.11 51.71,21.35 51.71,23.22 52.09,23.61 58.7,23.61 v1(60.22,22.08)
  Bottom Layer w0.254: R7.1 59,19.95 U6.2 59.18,22.08 v1(60.22,22.08)
ADC5: length 9.6
  Top Layer w0.254: U1.12 50.53,21.83 v1(47.78,21.83)
  Bottom Layer w0.254: v1(47.78,21.83) 48.93,21.83 U7.2 49.81,21.09 R8.1
ADC6: length 16.6
  Top Layer w0.254: U1.13 50.96,20.68 40.41,20.68 v1(40.28,20.56)
  Bottom Layer w0.254: v1(40.28,20.56) 39.34,20.56 U8.2 R9.1
ADC7: length 29.8
  Top Layer w0.254: U1.14 51.57,19.27 50.86,19.98 41.1,19.98 37.62,16.49 29.62,16.49 v1(28.22,17.89)
  Bottom Layer w0.254: v1(28.22,17.89) 29,18.67 ; 29,18.67 R10.1 ; 29,18.67 U9.2
ADC8: length 41.8
  Top Layer w0.254: U1.15 50.95,19.29 48.28,19.29 44.86,15.86 39.9,15.86 37.24,13.19 19.2,13.19 v1(17.42,14.97)
  Bottom Layer w0.254: U10.2 R11.1 18.97,14.97 v1(17.42,14.97)
ADC9: length 51
  Top Layer w0.254: 50.97,18.56 50.71,18.31 48.32,18.31 45.36,15.35 40.54,15.35 37.49,12.3 9.04,12.3 8.03,13.32 v1(7.52,13.32)
  Bottom Layer w0.254: U11.2 R12.1 8.68,13.32 v1(7.52,13.32)
ADC10: length 48.1
  Top Layer w0.254: U1.17 50.88,17.35 v1(48.19,17.35) ; v1(82.07,16.37) 82.07,11.2 U20.1
  Bottom Layer w0.254: v1(48.19,17.35) 48.19,17.8 48.67,18.27 51.08,18.27 51.2,18.15 56.8,18.15 56.92,18.27 57.81,18.27 57.84,18.24 59.25,18.24 59.41,18.08 59.41,16.67 59.72,16.37 63.11,16.37 63.45,16.02 64.34,16.02 64.98,16.66 64.98,16.8 65.56,17.38 67.46,17.38 67.84,17 70.26,17 71.27,15.98 81.69,15.98 v1(82.07,16.37) ; U20.1 82,11.27 R21.1
ADC15: length 18.8
  Top Layer w0.254: U1.22 50,12.94 41.86,12.94 U18.1
  Bottom Layer w0.254: R19.1 36.39,14 36.98,14.59 40.21,14.59 U18.1
ADC16: length 30.7
  Top Layer w0.254: U1.23 49.94,12.17 44.35,12.17 41.55,9.38 29.89,9.38 U17.1
  Bottom Layer w0.254: R18.1 U17.1
ADC17: length 4.8
  Bottom Layer w0.254: R38.1 R20.1 70,11 U19.1
ADR: length 3.9
  Top Layer w0.254: v1(55.52,12.81) 55.52,14.71 U1.26
  Bottom Layer w0.254: v1(55.52,12.81) 55.52,12.77 R37.2
LED: length 18
  Top Layer w0.254: U1.18 51.32,16.99 49.11,14.78 47.84,14.78 v1(47.14,15.48) ; R13.2 50,25 47.52,25 46.76,24.24 v1(46.76,21.57)
  Bottom Layer w0.254: v1(46.76,21.57) 47.14,21.19 v1(47.14,15.48)
LED_CONTROL: length 43.8
  Top Layer w0.254: Q1.1 34.05,18.05 R36.2 31.26,18 30.28,18.98 27.85,18.98 27.2,18.33 27.2,16.87 28.47,15.6 32.03,15.6 v1(33.68,13.95) ; v1(42.57,14.21) 43.33,13.44 49.09,13.44 U1.20
  Bottom Layer w0.254: v1(42.57,14.21) 42.57,12.3 42.06,11.79 41.05,11.79 39.14,13.7 38.51,13.7 36.85,12.05 35.59,12.05 v1(33.68,13.95)
RESET: length 56.8
  Top Layer w0.254: H1.2 53.5,5.94 H3.2 53.5,4.29 53.75,4.05 59.72,4.05 63.32,7.66 63.32,15.93 63.14,16.11 62.51,16.11 61.75,16.87 60.73,16.87 56.79,20.81 55.75,20.81 U1.6
  Bottom Layer w0.254: H1.2 49.27,4.94 45.79,4.94 H2.2 43.59,7.14 43.59,7.98 43.41,8.16 43.41,11.49 44.22,12.3 49.3,12.3 50,13 R22.1
SCL: length 18.5
  Top Layer w0.254: U1.32 58.37,16.11 58.37,15.49 58.44,15.41 58.44,9.03 56.97,7.55 56.24,7.55 54.5,5.82 H3.4
  Bottom Layer w0.254: 56.97,7.55 57.83,8.41 R2.1
SDA: length 14.8
  Top Layer w0.254: U1.31 56.68,16.99 57.81,15.86 v1(57.81,14.46) 57.81,10.94 H1.3 54,7.13 H3.3
  Bottom Layer w0.254: v1(57.81,14.46) 57.81,13.46 R1.1
SWCLK: length 16.5
  Top Layer w0.254: H2.3 46.11,9.38 48.97,9.38 U1.25
  Bottom Layer w0.254: H2.3 45.27,8.27 R23.1
SWDIO: length 42
  Top Layer w0.254: U1.24 49.28,10.81 H2.4 43.59,9.4 43.59,5.19 44.46,4.32 45.97,4.32 46.24,4.05 v1(47.27,4.05)
  Bottom Layer w0.254: v1(47.27,4.05) 60.29,4.05 R38.2
$1N3964: length 2.7
  Bottom Layer w0.508: R14.1 18.65,10.92 U13.1
$1N3993: length 2.4
  Bottom Layer w0.508: 46,16 44.9,17.1 U14.1
$1N3998: length 2
  Bottom Layer w0.254: R16.1 62.1,18.61 U15.1
$1N4003: length 3.3
  Bottom Layer w0.508: U16.1 86.73,8.73 R17.1
$1N4008: length 170.6
  Top Layer w0.508: v1(55.02,24.24) v1(53.11,24.24) ; Q1.3 34.5,23.61 v1(33.43,23.61)
  Bottom Layer w0.254: 95.26,16.91 95.39,16.91 95.47,17 96.6,18.12
  Bottom Layer w0.508: U16.2 92.66,14.39 92.66,18.75 ; 52,24.24 52,23.51 51.61,23.12 45.9,23.12 ; 52,24.24 v1(53.11,24.24) ; 52,24.24 51.71,24.24 ; LED4.2 30.57,21.06 22.57,21.06 LED3.2 20.54,19.03 12.54,19.03 LED2.2 12,17.93 11.07,17 7.64,17 6.5,15.86 5.49,15.86 4,17.34 LED13.2 3.86,17.64 2.44,17.64 1.21,16.41 1.21,8.7 1.93,7.98 4.85,7.98 5.99,9.13 19.4,9.13 U13.2 ; 95.47,17 103.51,17 LED12.2 ; LED8.2 67.54,21.95 75.46,21.95 LED9.2 77.3,21.19 85.3,21.19 LED10.2 87.46,19.03 92.39,19.03 92.66,18.75 ; 45.9,23.12 45.9,23.58 44.22,25.26 43.21,25.26 42,24.05 42,23.79 ; 45.9,23.12 U14.2 ; 92.66,18.75 94.42,17 95.26,17 ; U15.2 63.9,21.39 65.6,23.1 57.4,23.1 LED7.2 55.75,24.24 v1(55.02,24.24) ; v1(33.43,23.61) 32.31,22.49 ; LED5.2 42,23.79 ; 42,23.79 40.66,25.13 35.51,25.13 33.72,24.79 32.28,23.35 32.28,22.21
$1N4729: length 4.5
  Top Layer w0.254: R13.1 LED1.1
$1N4864: length 2.5
  Bottom Layer w0.254: LED2.1 R24.1
$1N4985: length 2.5
  Bottom Layer w0.254: LED3.1 R25.1
$1N5087: length 2.5
  Bottom Layer w0.254: LED4.1 R26.1
$1N5189: length 2.5
  Bottom Layer w0.254: LED5.1 R27.1
$1N5291: length 2.5
  Bottom Layer w0.254: R28.1 LED6.1
$1N5393: length 2.5
  Bottom Layer w0.254: R29.1 LED7.1
$1N5495: length 2.3
  Bottom Layer w0.254: LED8.1 66.45,20.06 R30.1
$1N5597: length 2.5
  Bottom Layer w0.254: LED9.1 R31.1
$1N5699: length 2.5
  Bottom Layer w0.254: LED10.1 R32.1
$1N5801: length 3.3
  Bottom Layer w0.254: 95.95,15.66 95.95,14.13 94.69,12.87
$1N5903: length 3.5
  Bottom Layer w0.254: LED12.1 R34.1
$1N6005: length 2.5
  Bottom Layer w0.254: LED13.1 R35.1

## Copper pours and planes (outline as drawn; the poured copper is in the pictures)
GND on Top Layer: -0.47,33.45 114.09,33.45 114.09,-14.93 -0.47,-14.93
GND on Bottom Layer: -4.91,30.08 113.58,30.08 113.58,-14.75 -4.91,-14.75
